# EAGLE design Tiny Tetris v1.3 (EAGLE 7.4.0)
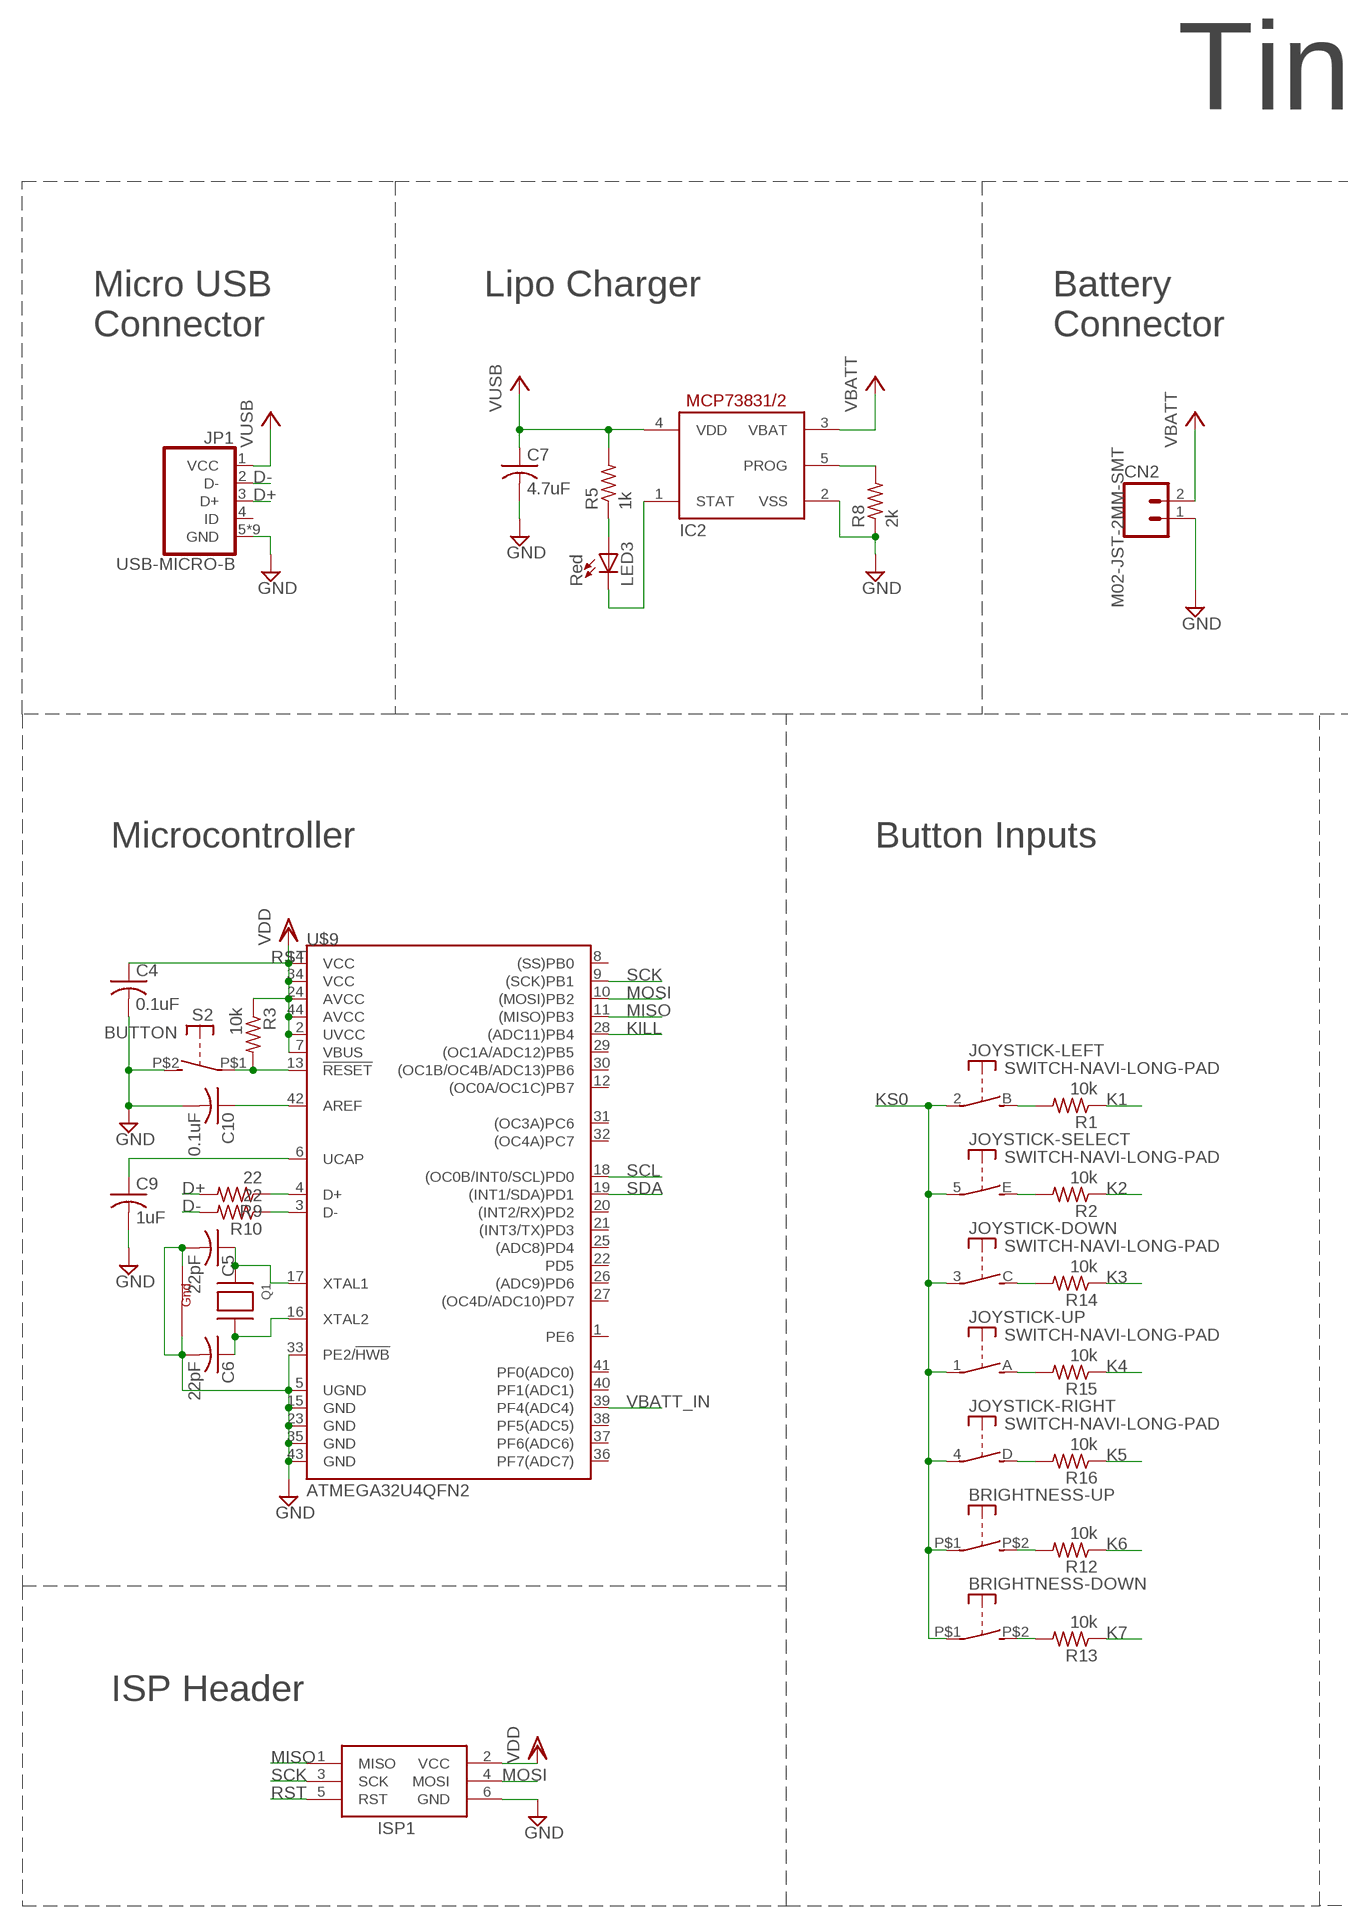
[diagram p0: schematic, sheet 1, part 1 of 2]
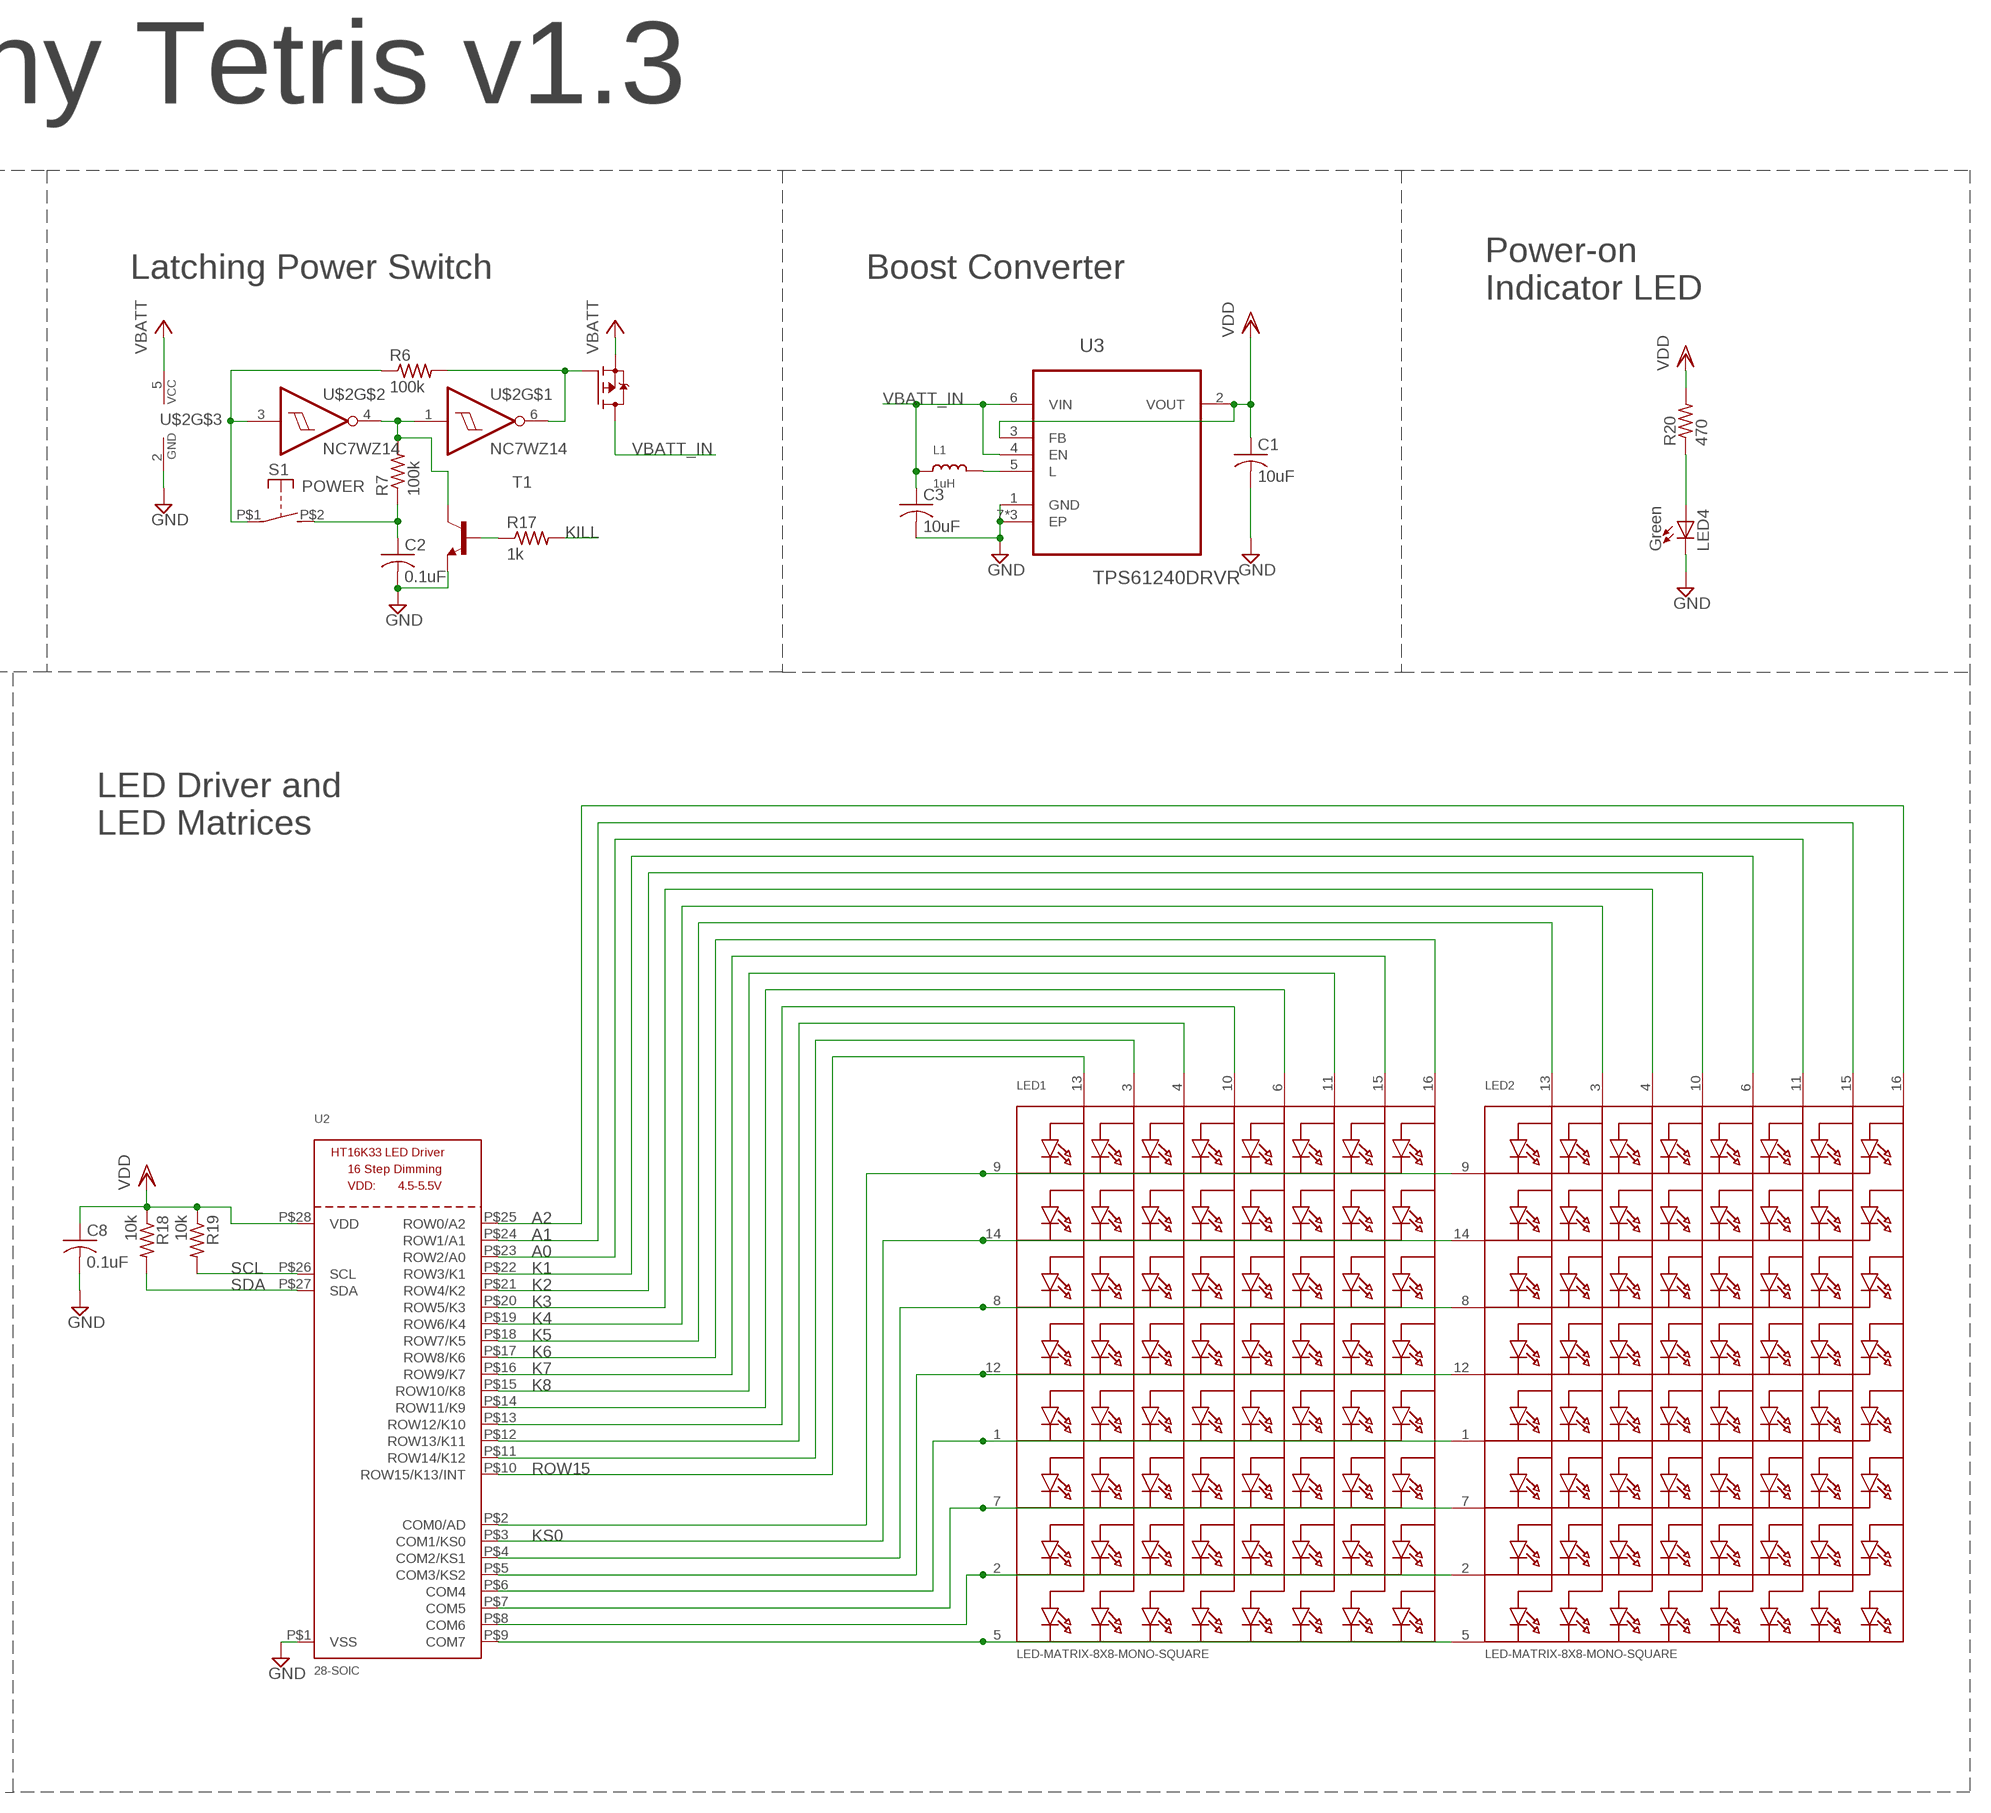
[diagram p1: schematic, sheet 1, part 2 of 2]

## Parts
BRIGHTNESS-DOWN  SWITCH-TACTSKRELGE010  [TACT-ALPS-SKRELGE010]
BRIGHTNESS-UP  SWITCH-TACTSKRELGE010  [TACT-ALPS-SKRELGE010]
C1  10uF  C-USC0603K  [C0603K]
C2  0.1uF  C-USC0603K  [C0603K]
C3  10uF  C-USC0603K  [C0603K]
C4  0.1uF  C-USC0603K  [C0603K]
C5  22pF  C-USC0603K  [C0603K]
C6  22pF  C-USC0603K  [C0603K]
C7  4.7uF  C-USC0603K  [C0603K]
C8  0.1uF  C-USC0603K  [C0603K]
C9  1uF  C-USC0603K  [C0603K]
C10  0.1uF  C-USC0603K  [C0603K]
CN2  M02-JST-2MM-SMT  M021X02_NO_SILK  [1X02_NO_SILK]
IC2  MCP73831/OT  [SOT23-5L]
ISP1  AVRISP-6  [AVRISP]
JOYSTICK-  SWITCH-NAVI-LONG-PAD  [JOYSTICK-NOKIA-3230-LONG-PAD]
JP1  USB-MICRO-B  [MICRO-USB-FCI-10103594]
L1  1uH  INDUCTOR0805  [0805]
LED1  LED-MATRIX-8X8-MONO-SQUARE  [LED-MATRIX-8X8-MONO-SQUARE]
LED2  LED-MATRIX-8X8-MONO-SQUARE  [LED-MATRIX-8X8-MONO-SQUARE]
LED3  Red  LED  [LED-0603-SIDEVIEW]
LED4  Green  LED  [LED-0603-SIDEVIEW]
Q1  XTAL-4-3225  [NX3225]
R1  10k  R-US_R0603  [R0603]
R2  10k  R-US_R0603  [R0603]
R3  10k  R-US_R0603  [R0603]
R5  1k  R-US_R0603  [R0603]
R6  100k  R-US_R0603  [R0603]
R7  100k  R-US_R0603  [R0603]
R8  2k  R-US_R0603  [R0603]
R9  22  R-US_R0603  [R0603]
R10  22  R-US_R0603  [R0603]
R12  10k  R-US_R0603  [R0603]
R13  10k  R-US_R0603  [R0603]
R14  10k  R-US_R0603  [R0603]
R15  10k  R-US_R0603  [R0603]
R16  10k  R-US_R0603  [R0603]
R17  1k  R-US_R0603  [R0603]
R18  10k  R-US_R0603  [R0603]
R19  10k  R-US_R0603  [R0603]
R20  470  R-US_R0603  [R0603]
S1  POWER  SWITCH-TACTSKRELGE010  [TACT-ALPS-SKRELGE010]
S2  BUTTON  SWITCH-TACTSKRELGE010  [TACT-ALPS-SKRELGE010]
T1  MMBT2222ALT1-NPN-SOT23-BEC  [SOT23-BEC]
U2  28-SOIC  HT16K33_SOP28  [SOP28_300MIL]
U3  TPS61240DRVR  [SON65P200X200X80-7N]
U$1  IRLML6402  [SOT23]
U$2  NC7WZ14  [SC-70-6]
U$9  ATMEGA32U4QFN2  [SPARKFUN-DIGITALIC_QFN-44-NOPAD]

## Nets
A0: LED2.11(A6) U2.P$23(ROW2/A0)
A1: LED2.15(A7) U2.P$24(ROW1/A1)
A2: LED2.16(A8) U2.P$25(ROW0/A2)
D+: JP1.3(D+) R9.2
D-: JP1.2(D-) R10.2
GND: C1.2 C2.2 C3.2 C4.2 C5.2 C6.2 C7.2 C8.2 C9.2 C10.2 CN2.1 IC2.2(VSS) ISP1.6(GND) JP1.5(GND) JP1.P$1(GND) JP1.P$2(GND) JP1.P$3(GND) JP1.P$4(GND) JP1.P$5(GND) JP1.P$6(GND) JP1.P$7(GND) JP1.P$8(GND) LED4.P$2(C) Q1.2(G2) Q1.4(G1) R8.1 S2.P$2(S) T1.E U2.P$1(VSS) U3.1(GND) U3.7(EP) U3.8(EP) U3.9(EP) U$2.2(GND) U$9.5(UGND) U$9.15(GND) U$9.23(GND) U$9.33(PE2/!HWB) U$9.35(GND) U$9.43(GND)
K1: LED2.6(A5) R1.1 U2.P$22(ROW3/K1)
K2: LED2.10(A4) R2.1 U2.P$21(ROW4/K2)
K3: LED2.4(A3) R14.1 U2.P$20(ROW5/K3)
K4: LED2.3(A2) R15.1 U2.P$19(ROW6/K4)
K5: LED2.13(A1) R16.1 U2.P$18(ROW7/K5)
K6: LED1.16(A8) R12.1 U2.P$17(ROW8/K6)
K7: LED1.15(A7) R13.1 U2.P$16(ROW9/K7)
K8: LED1.11(A6) U2.P$15(ROW10/K8)
KILL: R17.2 U$9.28((ADC11)PB4)
KS0: BRIGHTNESS-DOWN.P$1(P) BRIGHTNESS-UP.P$1(P) JOYSTICK-.1(UP:P) JOYSTICK-.2(LEFT:P) JOYSTICK-.3(DOWN:P) JOYSTICK-.4(RIGHT:P) JOYSTICK-.5(SELECT:P) LED1.14(K2) LED2.14(K2) U2.P$3(COM1/KS0)
MISO: ISP1.1(MISO) U$9.11((MISO)PB3)
MOSI: ISP1.4(MOSI) U$9.10((MOSI)PB2)
N$1: LED1.5(K8) LED2.5(K8) U2.P$9(COM7)
N$2: LED3.P$1(A) R5.1
N$3: JOYSTICK-.C(DOWN:S) R14.2
N$4: R6.2 U$1.1(G) U$2.6(O)
N$5: R17.1 T1.B
N$6: R6.1 S1.P$1(P) U$2.3(I)
N$7: JOYSTICK-.E(SELECT:S) R2.2
N$8: LED1.9(K1) LED2.9(K1) U2.P$2(COM0/AD)
N$9: JOYSTICK-.D(RIGHT:S) R16.2
N$10: C2.1 R7.1 S1.P$2(S)
N$11: JOYSTICK-.B(LEFT:S) R1.2
N$12: R7.2 T1.C U$2.1(I) U$2.4(O)
N$13: JOYSTICK-.A(UP:S) R15.2
N$15: C10.1 U$9.42(AREF)
N$16: R9.1 U$9.4(D+)
N$17: IC2.1(STAT) LED3.P$2(C)
N$18: IC2.5(PROG) R8.2
N$19: R10.1 U$9.3(D-)
N$20: C9.1 U$9.6(UCAP)
N$21: BRIGHTNESS-UP.P$2(S) R12.2
N$22: LED1.3(A2) U2.P$11(ROW14/K12)
N$23: LED1.4(A3) U2.P$12(ROW13/K11)
N$24: LED1.10(A4) U2.P$13(ROW12/K10)
N$25: LED1.6(A5) U2.P$14(ROW11/K9)
N$26: BRIGHTNESS-DOWN.P$2(S) R13.2
N$27: LED4.P$1(A) R20.1
N$29: L1.2 U3.5(L)
N$30: LED1.8(K3) LED2.8(K3) U2.P$4(COM2/KS1)
N$31: C5.1 Q1.1(X1) U$9.17(XTAL1)
N$32: LED1.12(K4) LED2.12(K4) U2.P$5(COM3/KS2)
N$33: LED1.1(K5) LED2.1(K5) U2.P$6(COM4)
N$34: LED1.7(K6) LED2.7(K6) U2.P$7(COM5)
N$35: LED1.2(K7) LED2.2(K7) U2.P$8(COM6)
N$36: C6.1 Q1.3(X2) U$9.16(XTAL2)
ROW15: LED1.13(A1) U2.P$10(ROW15/K13/INT)
RST: ISP1.5(RST) R3.2 S2.P$1(P) U$9.13(!RESET)
SCK: ISP1.3(SCK) U$9.9((SCK)PB1)
SCL: R19.2 U2.P$26(SCL) U$9.18((OC0B/INT0/SCL)PD0)
SDA: R18.2 U2.P$27(SDA) U$9.19((INT1/SDA)PD1)
VBATT: CN2.2 IC2.3(VBAT) U$1.2(S) U$2.5(VCC)
VBATT_IN: C3.1 L1.1 U3.4(EN) U3.6(VIN) U$1.3(D) U$9.39(PF4(ADC4))
VDD: C1.1 C4.1 C8.1 ISP1.2(VCC) R3.1 R18.1 R19.1 R20.2 U2.P$28(VDD) U3.2(VOUT) U3.3(FB) U$9.2(UVCC) U$9.7(VBUS) U$9.14(VCC) U$9.24(AVCC) U$9.34(VCC) U$9.44(AVCC)
VUSB: C7.1 IC2.4(VDD) JP1.1(VCC) R5.2
Unconnected: JP1.4(ID) U$9.1(PE6) U$9.8((SS)PB0) U$9.12((OC0A/OC1C)PB7) U$9.20((INT2/RX)PD2) U$9.21((INT3/TX)PD3) U$9.22(PD5) U$9.25((ADC8)PD4) U$9.26((ADC9)PD6) U$9.27((OC4D/ADC10)PD7) U$9.29((OC1A/ADC12)PB5) U$9.30((OC1B/OC4B/ADC13)PB6) U$9.31((OC3A)PC6) U$9.32((OC4A)PC7) U$9.36(PF7(ADC7)) U$9.37(PF6(ADC6)) U$9.38(PF5(ADC5)) U$9.40(PF1(ADC1)) U$9.41(PF0(ADC0))

## Notes on the sheet
- Tiny Tetris v1.3
- Power-on
  Indicator LED
- Micro USB
  Connector
- Lipo Charger
- Battery
  Connector
- Latching Power Switch | Boost Converter
- Microcontroller | Button Inputs
- LED Driver and 
  LED Matrices
- ISP Header

## Library data of the parts
BRIGHTNESS-DOWN BRIGHTNESS-UP S1 S2 = Jianan Li:SWITCH-TACT
C1-C10 = resistor:C-US: CAPACITOR, American symbol
CN2 = SparkFun-Connectors:M02: Standard 2-pin 0.1" header. Use with - straight break away headers ( PRT-00116) - right angle break away headers (PRT-00553) - swiss pins (PRT-00743) - machine pins (PRT-00117) - female headers (PRT-00115) Molex polarized connector foot print use with: PRT-08233 with associated crimp pins and housings. 2.54_SCREWTERM for use with PRT-10571. 3.5mm Screw Terminal footprints for PRT-08084 5mm Screw Terminal footprints for use with PRT-08433
IC2 = adafruit:MCP73831: MCP73831/2 Miniature Single-Cell, Fully Integrated Li-Ion, Li-Polymer Charge Management Controllers. Nice and small simple lipoly charge controller, with adjustable current and status output (LED) http://www.ladyada.net/library/pcb/eaglelibrary.html
ISP1 = adafruit:AVRISP: AVR ISP HEADER Standard 6 pin header for AVR programming
JOYSTICK- = Jianan Li:SWITCH-NAVI
JP1 = Jianan Li:USB-MICRO-B
L1 = microbuilder:INDUCTOR: Inductors 0603: 10nH Ceramic Inductor - microwire antenna/RF (Digikey: 712-1434-2-ND) 0805: 560nH Ceramic Inductor - RF (Digikey: 553-1047-1-ND) 270nH Ceramic Inductor - Q = 40@250MHz, +-5%, 1 Ohm DC Resistance (Digikey: 535-10506-2-ND) 1007 (2518 Metric) SMT: 10µH 10% 250mOhm 820mA 1007 Inductor (Digikey: 587-2189-1-ND) 22µH 10% 500mOhm 580mA 1007 Inductor (Digikey: 587-2190-1-ND) 47µH 10% 950mOhm 420mA 1007 Inductor (Digikey: 587-2191-1-ND) 47µH 5% 100mOhm 1A 1008 Inductor (Digikey: 732-1816-1-ND) 5.0x5.0mm (Taiyo Yuden NR5040 Series) 6.8µH 20% 2.3A 64mOhm Inductor (Digikey: 587-2374-2-ND) 5.0x5.0mm (TDK VLC5045 Series) 4.7µH 20% 3.3A 34mOhm Inductor (Digikey: 445-6526-1-ND) 6.8µH 20% 2.7A 46mOhm Inductor (Digikey: 445-6527-1-ND) 6.0x6.0mm (TDK VLC6045 Series) 4.7µH 20% 3.8A 27mOhm Inductor (Digikey: 445-6538-2-ND) 6.8µH 20% 3A 41mOhm Inductor (Digikey: 445-6540-1-ND) 6.2µH 30% 2.2A 45mOhm Inductor (Digikey: SRR5028-6R2YCT-ND) - Not TDK VLC6045 but footprint should match 6.0x6.0mm (TDK SLF6045 Series) 6.8uH 30% 2A 33mOhm Inductor (Digikey: 445-4572-1-ND, Mouser: 810-SLF645T6R8N2R0PF)
LED1 LED2 = Jianan Li:LED-MATRIX-8X8-MONO-SQUARE
LED3 LED4 = Jianan Li:LED
Q1 = adafruit:XTAL-4: Classic 4-pin 3.2 x 2.5mm crystal
R1-R3 R5-R10 R12-R20 = resistor:R-US_: RESISTOR, American symbol
T1 = transistor:*-NPN-: NPN Transistror BF959 corrected 2008.03.06
U2 = microbuilder:HT16K33_SOP28
U3 = Texas Instruments_By_element14_Batch_1:TPS61240DRVR: 3.5-MHz High Efficiency Step-Up Converter; MPN: TPS61240DRVR; OC_FARNELL: -; OC_NEWARK: 25R0113; PACKAGE: SON-6; SUPPLIER: Texas Instruments
U$1 = Jianan Li:IRLML6402
U$2 = Jianan Li:NC7WZ14
U$9 = SparkFun-DigitalIC:ATMEGA32U4: Atmel 44-pin 8-bit Microcontroller with 32KBytes of ISP Flash and USB Controller ----- Please use the QFN-44-NOPAD_1:1 package for the footprint of all boards using a 32U4. Route traces directly away from the pads as much as possible.

## Board
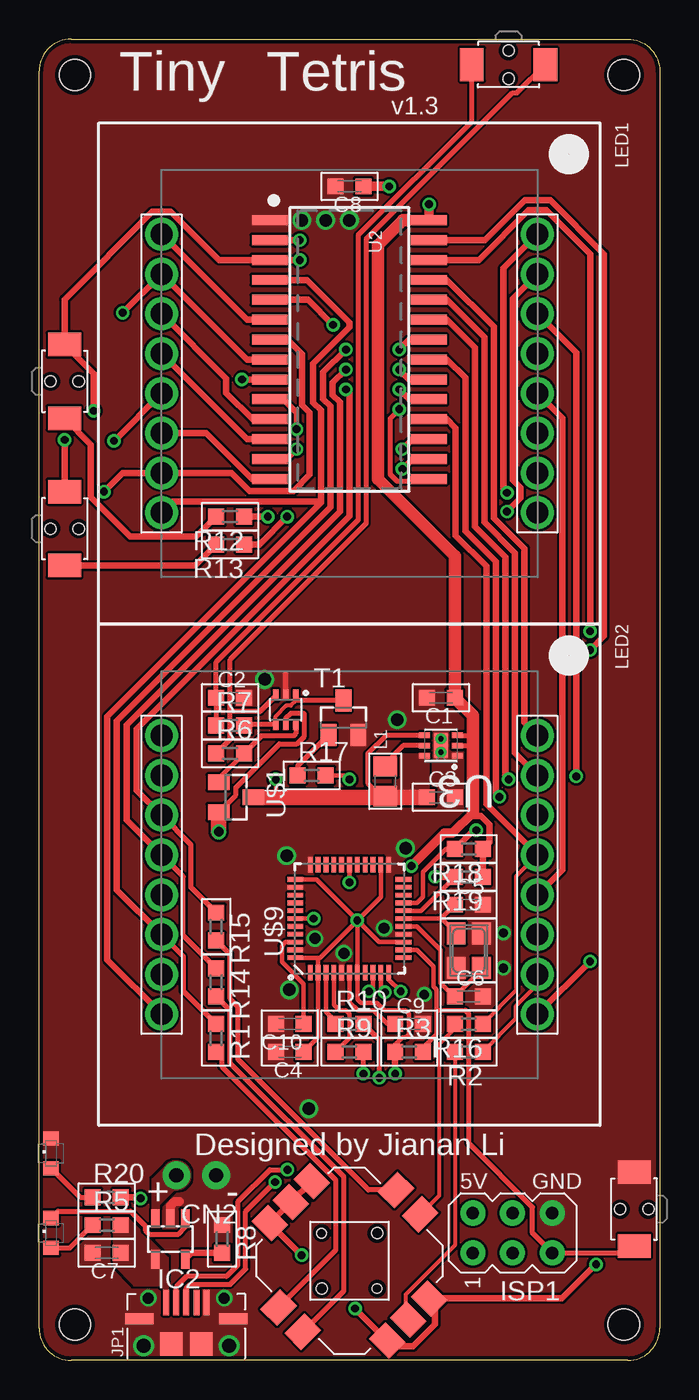
[diagram p2: board, top side]
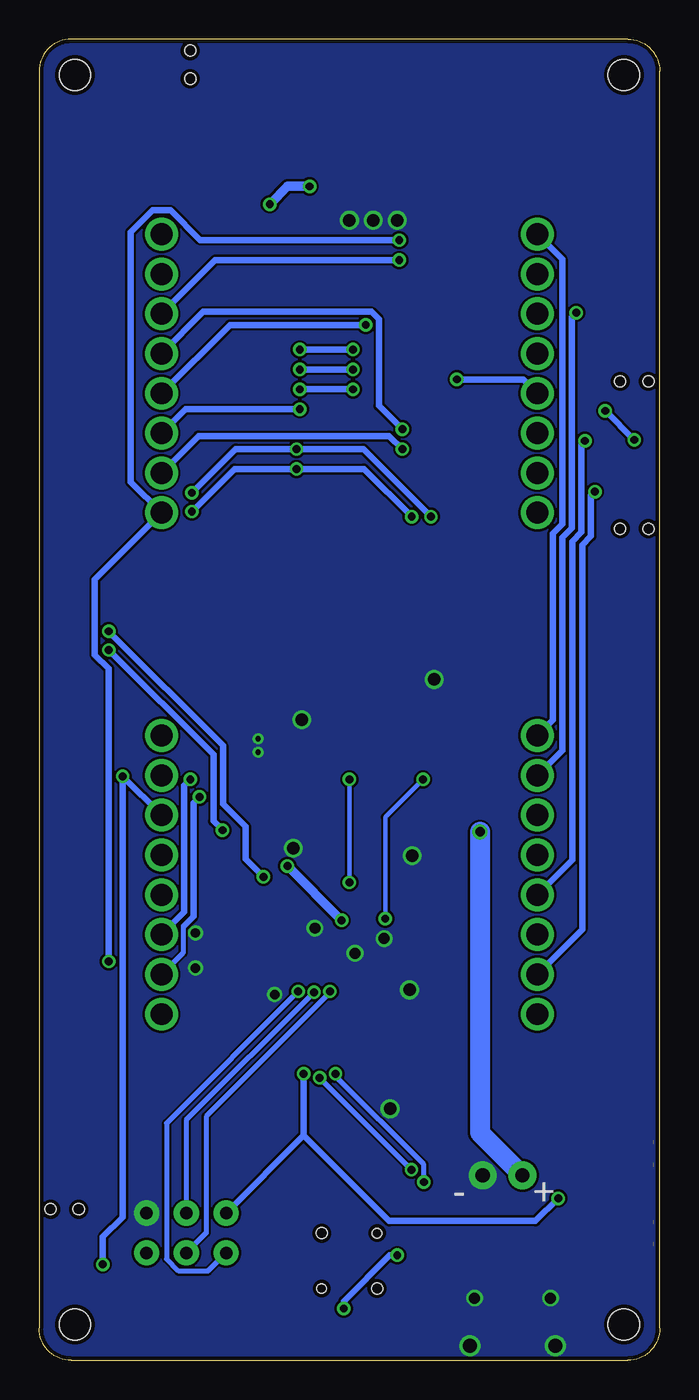
[diagram p3: board, bottom side, seen from below]

Size 39.62 x 84.33 mm. Coordinates in mm from the lower left corner, seen from the top.
Outline: 0,2.03 0,82.3 arc-90 2.03,84.33 37.59,84.33 arc-90 39.62,82.3 39.62,2.03 arc-90 37.59,0 2.03,0 arc-90 0,2.03
Copper layers (1*16): Top 0.0356mm / dielectric 1.5011mm / Bottom 0.0356mm
Design rules "OSH Park *": minimum track width 6mil, minimum drill 13mil, track to track 6mil, track to pad 6mil, pad to pad 6mil, via to via 6mil, smd to smd 6mil, copper to edge 10mil, drill to drill 6mil, minimum pad ring 7mil, minimum via ring 7mil, stop-mask expansion 0mil, vias tented up to drill 40mil, thermal gap 10mil
Holes 2 mm at 37.34,2.29 37.34,82.04 2.29,2.29 2.29,82.04

### Footprints (pad centres in the part's own frame; a part is rotated, then mirrored left to right if it is on the bottom)
TACT-ALPS-SKRELGE010 = smd 1.5 x 2.1: P$1 -2.35,0; P$2 2.35,0 | hole 0.7: 0,0.9; 0,-0.9
C0603K = smd 1.016 x 1.016: 1 -0.889,0; 2 0.889,0
1X02_NO_SILK = drill 0.9 pad 1.778: 1 0,0; 2 2.54,0
SOT23-5L = smd 0.55 x 1.2: 1 -0.95,-1.3; 2 0,-1.3; 3 0.95,-1.3; 4 0.95,1.3; 5 -0.95,1.3
AVRISP = drill 0.8 pad 1.6: 1 -1.27,2.54; 2 1.27,2.54; 3 -1.27,0; 4 1.27,0; 5 -1.27,-2.54; 6 1.27,-2.54
JOYSTICK-NOKIA-3230-LONG-PAD = smd 1.8 x 1.5 rotated 315: 1 -2.404,5.091; 2 -5.091,2.404; 3 2.404,-5.091; 4 5.091,-2.404; 5 -3.748,3.748; E 3.748,-3.748 | smd 1.5 x 1.8 rotated 315: A 2.97,4.525; B -4.525,-2.97; C -2.97,-4.525; D 4.525,2.97 | hole 0.7: 1.768,1.768; -1.768,-1.768 | hole 0.6: -1.768,1.768; 1.768,-1.768
MICRO-USB-FCI-10103594 = smd 0.38 x 1.6: 1 -1.3,3.561; 2 -0.65,3.561; 3 0,3.561; 4 0.65,3.561; 5 1.3,3.561 | drill 0.7: P$1 -2.425,3.841; P$2 2.425,3.841 | drill 0.9: P$3 -2.725,0.811; P$4 2.725,0.811 | smd 1.425 x 1.5: P$5 -0.963,0.901; P$6 0.963,0.901 | smd 1.825 x 0.7: P$7 -3,2.511; P$8 3,2.511
0805 = smd 1.3 x 1.5: 1 -0.95,0; 2 0.95,0
LED-MATRIX-8X8-MONO-SQUARE = drill 1.4 pad 2.032: 1 -8.89,-12; 2 -6.35,-12; 3 -3.81,-12; 4 -1.27,-12; 5 1.27,-12; 6 3.81,-12; 7 6.35,-12; 8 8.89,-12; 9 8.89,12; 10 6.35,12; 11 3.81,12; 12 1.27,12; 13 -1.27,12; 14 -3.81,12; 15 -6.35,12; 16 -8.89,12
LED-0603-SIDEVIEW = smd 0.9 x 1: P$1 -0.95,0; P$2 0.95,0
NX3225 = smd 1.4 x 1.2: 1 -1.1,-0.8; 2 1.1,-0.8; 3 1.1,0.8; 4 -1.1,0.8
R0603 = smd 1.016 x 1.016: 1 -0.889,0; 2 0.889,0
SOT23-BEC = smd 1 x 1.4: B -0.95,-1.1; C 0,1.1; E 0.95,-1.1
SOP28_300MIL = smd 0.635 x 2.286: P$1 -8.255,-5.08; P$2 -6.985,-5.08; P$3 -5.715,-5.08; P$4 -4.445,-5.08; P$5 -3.175,-5.08; P$6 -1.905,-5.08; P$7 -0.635,-5.08; P$8 0.635,-5.08; P$9 1.905,-5.08; P$10 3.175,-5.08; P$11 4.445,-5.08; P$12 5.715,-5.08; P$13 6.985,-5.08; P$14 8.255,-5.08; P$15 8.255,5.08; P$16 6.985,5.08; P$17 5.715,5.08; P$18 4.445,5.08; P$19 3.175,5.08; P$20 1.905,5.08; P$21 0.635,5.08; P$22 -0.635,5.08; P$23 -1.905,5.08; P$24 -3.175,5.08; P$25 -4.445,5.08; P$26 -5.715,5.08; P$27 -6.985,5.08; P$28 -8.255,5.08
SON65P200X200X80-7N = smd 0.7 x 0.35: 1 -1.05,0.65; 2 -1.05,0; 3 -1.05,-0.65; 4 1.05,-0.65; 5 1.05,0; 6 1.05,0.65 | smd 0.9 x 1.6: 7 0,0 | drill 0.33: 8 0,0.43; 9 0,-0.43
SOT23 = smd 1 x 1.4: 1 -0.95,-1.1; 2 0.95,-1.1; 3 0,1.1
SC-70-6 = smd 0.35 x 0.7: 1 -0.65,-0.95; 2 0,-0.95; 3 0.65,-0.95; 4 0.65,0.95; 5 0,0.95; 6 -0.65,0.95
SPARKFUN-DIGITALIC_QFN-44-NOPAD = smd 1 x 0.3: 1 -3.45,2.5; 2 -3.45,2; 3 -3.45,1.5; 4 -3.45,1; 5 -3.45,0.5; 6 -3.45,0; 7 -3.45,-0.5; 8 -3.45,-1; 9 -3.45,-1.5; 10 -3.45,-2; 11 -3.45,-2.5; 23 3.45,-2.5; 24 3.45,-2; 25 3.45,-1.5; 26 3.45,-1; 27 3.45,-0.5; 28 3.45,0; 29 3.45,0.5; 30 3.45,1; 31 3.45,1.5; 32 3.45,2; 33 3.45,2.5 | smd 0.3 x 1: 12 -2.5,-3.45; 13 -2,-3.45; 14 -1.5,-3.45; 15 -1,-3.45; 16 -0.5,-3.45; 17 0,-3.45; 18 0.5,-3.45; 19 1,-3.45; 20 1.5,-3.45; 21 2,-3.45; 22 2.5,-3.45; 34 2.5,3.45; 35 2,3.45; 36 1.5,3.45; 37 1,3.45; 38 0.5,3.45; 39 0,3.45; 40 -0.5,3.45; 41 -1,3.45; 42 -1.5,3.45; 43 -2,3.45; 44 -2.5,3.45

### Placement (x,y rotation side)
BRIGHTNESS-DOWN  1.63,53.09 270 top
BRIGHTNESS-UP  1.63,62.48 270 top
C1  25.65,42.29 180 top
C2  12.19,42.29 0 top
C3  25.65,35.94 0 top
C4  16,19.69 180 top
C5  27.43,29.08 0 top
C6  27.43,23.24 0 top
C7  4.32,6.86 180 top
C8  19.81,74.93 180 top
C9  23.62,21.46 0 top
C10  16,21.46 180 top
CN2  11.3,11.81 180 top
IC2  8.38,7.75 180 top
ISP1  30.23,8.13 90 top
JOYSTICK-  19.81,6.35 0 top
JP1  9.4,0.13 0 top
L1  22.1,36.96 90 top
LED1  19.81,62.99 270 top
LED2  19.81,30.99 270 top
LED3  0.76,8.13 90 top
LED4  0.76,13.21 90 top
Q1  27.43,26.16 270 top
R1  11.3,20.57 270 top
R2  27.43,19.69 180 top
R3  23.62,19.69 0 top
R5  4.32,8.64 0 top
R6  12.19,38.73 0 top
R7  12.19,40.51 0 top
R8  11.68,7.75 270 top
R9  19.81,19.69 0 top
R10  19.81,21.46 0 top
R12  12.19,53.85 180 top
R13  12.19,52.07 180 top
R14  11.3,24.13 270 top
R15  11.3,27.69 270 top
R16  27.43,21.46 180 top
R17  17.4,37.34 0 top
R18  27.43,32.64 180 top
R19  27.43,30.86 180 top
R20  4.32,10.41 0 top
S1  29.97,82.7 180 top
S2  38,9.65 90 top
T1  19.43,41.02 0 top
U2  19.81,64.52 270 top
U3  25.65,39.24 180 top
U$1  12.57,35.94 270 top
U$2  15.75,41.53 180 top
U$9  19.81,28.19 90 top

### Tracks (layer width: path | path; a pad name or v marks a point on that pad's centre or on a via)
A0  (via drill 0.5)
  Top 0.406: U2.P$23 26.04,66.42 27.81,64.64 27.81,53.21 29.77,51.26 29.77,37.29 v29.97,37.08
  Bottom 0.406: LED2.11 30.38,28.61 30.38,36.68 v29.97,37.08
A1
  Top 0.406: U2.P$24 26.04,67.69 28.42,65.3 28.42,53.49 30.38,51.54 30.38,38.77 LED2.15
A2
  Top 0.406: U2.P$25 26.04,68.96 29.03,65.96 29.03,53.77 30.99,51.82 30.99,40.7 LED2.16
D+  (via drill 0.5)
  Top 0.305: JP1.3 9.4,4.6 9.65,4.85 12.19,4.85 13.18,5.84 13.18,9.5 v15.06,11.38 | v20.7,18.29 R9.2
  Bottom 0.305: v15.06,11.38 15.06,12.5 20.7,18.14 v20.7,18.29
D-  (via drill 0.5)
  Top 0.305: JP1.2 8.75,4.68 9.42,5.36 11.96,5.36 12.68,6.07 12.68,10.11 14.73,12.17 v15.85,12.17 | v21.72,18.03 21.72,20.45 R10.2
  Bottom 0.305: v15.85,12.17 v21.72,18.03
GND  (via drill 0.6, 0.7, 0.8)
  Top 0.356: U$2.2 15.75,43.82
  Top 0.559: IC2.2 8.38,9.86 8.66,10.14 8.94,10.14
  other vias: 17.22,16.05 14.4,43.46 16.76,72.77 22.02,27.58 15.8,32.21 23.39,32.69 22.86,40.89 15.98,23.65 19.46,25.98 17.6,26.92 24.59,23.34 29.64,25.04 29.64,27.28 18.29,72.77 19.81,72.77
  pour Bottom (no thermals): 2.03,84.33 arc90 0,82.3 0,2.03 arc90 2.03,0 37.59,0 arc90 39.62,2.03 39.62,82.3 arc90 37.59,84.33
  pour Top (rank 6, no thermals): 2.03,84.33 arc90 0,82.3 0,2.03 arc90 2.03,0 37.59,0 arc90 39.62,2.03 39.62,82.3 arc90 37.59,84.33
K1  (via drill 0.5)
  Top 0.305: LED2.6 9.2,25.8 9.2,23.57 R1.1
  Top 0.406: LED2.6 4.95,30.04 4.95,40.82 18.59,54.46 18.59,60.91 18.14,61.37 18.14,63.07 v19.58,64.52 | v22.99,64.52 23.62,65.15 U2.P$22
  Bottom 0.406: v19.58,64.52 v22.99,64.52
K2  (via drill 0.5)
  Top 0.254: LED2.10 31.81,23.99 30.46,22.63 30.46,21.82 R2.1
  Top 0.406: U2.P$21 26.04,63.88 27.2,62.71 27.2,52.93 29.16,50.98 29.16,36.2 v29.39,35.97
  Bottom 0.305: 30.38,27.74 30.43,27.74 30.43,26.02 LED2.10
  Bottom 0.406: 30.38,27.74 29.77,28.35 29.77,35.59 v29.39,35.97
K3  (via drill 0.5)
  Top 0.305: R14.1 9.2,27.13 9.2,30.88 LED2.4
  Top 0.406: LED2.4 5.59,34.48 5.59,40.56 19.2,54.18 19.2,61.16 18.75,61.62 18.75,62.41 v19.58,63.25 | v22.99,63.25 23.62,62.61 U2.P$20
  Bottom 0.406: v19.58,63.25 v22.99,63.25
K4  (via drill 0.5)
  Top 0.305: R15.1 9.7,30.18 9.7,32.91 LED2.3
  Top 0.406: LED2.3 6.22,36.39 6.22,40.31 19.81,53.9 19.81,61.75 v19.58,61.98 | v22.99,61.98 23.62,61.34 U2.P$19
  Bottom 0.406: v19.58,61.98 v22.99,61.98
K5
  Top 0.254: LED2.13 30.46,30.9 30.46,23.6 R16.1
  Top 0.406: U2.P$18 26.04,60.07 26.59,59.51 26.59,52.65 28.55,50.7 28.55,35.52 LED2.13
K6  (via drill 0.5)
  Top 0.406: U2.P$17 23.83,58.8 v23.19,58.17 | LED1.16 29.64,69.71 29.64,55.6 v29.87,55.37 | v14.61,53.85 R12.1
  Bottom 0.406: v14.61,53.85 18.92,58.17 v23.19,58.17 27.08,58.17 v29.87,55.37
K7  (via drill 0.5)
  Top 0.406: U2.P$16 23.83,57.53 v23.19,56.9 | LED1.15 30.25,67.78 30.25,56.19 30.73,55.7 30.73,55.04 v29.87,54.18 | v15.84,53.85 14.06,52.07 R13.1
  Bottom 0.406: v29.87,54.18 27.15,56.9 v23.19,56.9 18.88,56.9 v15.84,53.85
K8  (via drill 0.5)
  Top 0.305: v22.99,60.71 22.4,60.12 22.4,56.57 22.86,56.11 23.52,56.11 23.67,56.26 U2.P$15
  Bottom 0.406: LED1.11 30.29,60.71 v22.99,60.71
KEEPOUT
  pour Top (no thermals): 15.42,42.75 16.08,42.75 16.08,42.21 15.42,42.21
  pour Top (no thermals): 9.78,4.6 10.24,4.6 10.24,2.97 9.78,2.97
  pour Top: 8,9.6 8.79,9.6 8.79,8.36 8,8.36
  pour Top: 26.43,39.41 26.97,39.41 26.97,39.04 26.43,39.04
KILL  (via drill 0.5)
  Top 0.279: U$9.28 v19.81,30.51 | v19.81,37.08 19.56,37.34 R17.2
  Bottom 0.279: v19.81,30.51 v19.81,37.08
KS0  (via drill 0.5)
  Top 0.406: v16.64,70.23 U2.P$3 11.48,70.23 8.41,73.3 7.21,73.3 1.63,67.72 BRIGHTNESS-UP.P$1 3.48,62.98 v3.48,60.6 | v34.29,37.28 34.29,64.32 LED1.14 | BRIGHTNESS-DOWN.P$1 v1.63,58.75 | JOYSTICK-.1 JOYSTICK-.5 | JOYSTICK-.5 | JOYSTICK-.5 | JOYSTICK-.5 JOYSTICK-.2 v16.76,6.71 | v20.17,3.3 JOYSTICK-.3 22.59,0.89 23.88,0.89 25.27,2.29 25.27,3.58 JOYSTICK-.4 33.38,3.95 v35.56,6.12
  Bottom 0.406: LED2.14 v34.29,37.28 34.29,9.14 35.56,7.87 v35.56,6.12 | v16.64,70.23 28.38,70.23 LED1.14 | v3.48,60.6 v1.63,58.75 | v16.76,6.71 17.24,6.71 20.17,3.78 v20.17,3.3
MISO  (via drill 0.5)
  Top 0.279: U$9.11 22.31,24.32 v23.09,23.55
  Bottom 0.305: ISP1.1 28.85,5.69 30.71,5.69 31.5,6.48 31.5,15.14 v23.09,23.55
MOSI  (via drill 0.5)
  Top 0.279: U$9.10 21.81,23.76 v22.07,23.5
  Bottom 0.305: ISP1.4 30.23,15.34 v22.07,23.5
N$1  (via drill 0.5)
  Top 0.406: LED1.5 v4.78,58.69 | v12.95,62.61 U2.P$9
  Bottom 0.406: LED2.5 5.59,31.94 5.59,52.27 5,52.86 5,58.46 v4.78,58.69 | LED1.5 8.7,62.61 v12.95,62.61
N$2
  Top 0.305: LED3.P$1 1.97,7.18 R5.1
N$3
  Top 0.305: JOYSTICK-.C 19.46,4.44 19.46,11.71 12.17,19 12.17,22.38 R14.2
N$4
  Top 0.279: U$1.1 11.47,37.13 R6.2
  Top 0.305: U$2.6 16.4,40.02 16.23,39.85 14.2,39.85 R6.2 13.06,38.73 | U$1.1 11.49,36.89
N$5
  Top 0.305: T1.B 16.51,37.95 R17.1
N$6
  Top 0.305: S1.P$1 30.52,80.9 30.23,80.9 20.88,71.55 20.88,53.42 12.19,44.73 12.19,41.4 | R6.1 12.19,39.62 12.19,41.4 | U$2.3 15.1,42.4 14.1,41.4 12.19,41.4
  Top 0.406: 32.53,82.7 S1.P$1
N$7
  Top 0.254: R2.2 26.54,7.34 23.39,4.19 23.39,2.77 JOYSTICK-.E
N$8  (via drill 0.5)
  Top 0.406: v16.64,71.5 U2.P$2 | v35.18,25.47 LED2.9
  Bottom 0.406: v16.64,71.5 29.34,71.5 31.24,73.41 32.39,73.41 33.78,72.01 33.78,56.07 LED1.9 36.07,49.85 36.07,45.03 35.18,44.15 v35.18,25.47
N$9
  Top 0.254: R16.2 26.54,21.18 25.53,20.17 25.53,10.51 JOYSTICK-.D
  Top 0.406: JOYSTICK-.D 24.36,9.34
N$10
  Top 0.305: S1.P$2 27.62,79.06 20.37,71.81 20.37,53.65 11.3,44.58 C2.1 R7.1
N$11
  Top 0.305: JOYSTICK-.B 18.95,7.04 18.95,11.48 11.66,18.77 11.66,19.33 R1.2
N$12
  Top 0.254: U$2.1 16.4,42.13 16.39,42.12 16.05,41.78 15.77,41.78 15.1,41.11 U$2.4
  Top 0.305: T1.C 16.39,42.12 16.39,42.47 U$2.1 | U$2.4 13.15,40.58 R7.2
N$13
  Top 0.305: JOYSTICK-.A 21.03,10.88 12.68,19.23 12.68,22.61 12.17,23.11 12.17,25.93 R15.2
N$15
  Top 0.279: U$9.42 15.72,26.69 15.49,26.47 15.49,25.43 16.89,24.03 C10.1
N$16
  Top 0.279: R9.1 19.81,20.57 19.81,22.1 19.58,22.33 19.18,22.33 18.81,22.69 U$9.4
N$17
  Top 0.305: IC2.1 9.33,8.49 8.89,8.05 7.04,8.05 6.78,8.31 6.78,8.59 5.84,9.52 1.21,9.52 LED3.P$2
N$18
  Top 0.406: R8.2 9.74,6.86 IC2.5
N$19
  Top 0.279: U$9.3 18.31,22.25 18.92,21.64 R10.1
N$20
  Top 0.279: 22.48,21.46 22.23,21.46 21.36,22.33 20.35,22.33 19.81,22.86 U$9.6
  Top 0.305: C9.1 22.48,21.46
N$21
  Top 0.406: BRIGHTNESS-UP.P$2 3.3,58.46 3.3,55.09 5.82,52.58 10.03,52.58 R12.2
N$22
  Top 0.406: LED1.3 11.94,62.68 11.94,61.75 13.61,60.07 U2.P$11 13.97,60.07
N$23
  Top 0.406: LED1.4 13.27,58.8 U2.P$12
N$24  (via drill 0.5)
  Top 0.406: v16.43,58.17 15.8,57.53 U2.P$13
  Bottom 0.406: LED1.10 29.45,59 17.27,59 v16.43,58.17
N$25
  Top 0.406: LED1.6 10.67,59.18 13.59,56.26 U2.P$14
N$26
  Top 0.406: BRIGHTNESS-DOWN.P$2 9.97,50.74 R13.2
N$27
  Top 0.305: LED4.P$1 2.61,10.41 R20.1
N$29
  Top 0.305: U3.5 23.24,39.24 22.1,38.1 L1.2
N$30
  Top 0.406: LED2.8 4.34,25.57 4.34,41.1 17.98,54.74 17.98,54.81 | U2.P$4 17.09,68.96 19.81,66.24 19.81,65.94 17.5,63.63 17.5,61.14 17.98,60.66 17.98,54.81 | LED1.8 8.52,54.81 17.98,54.81
N$31
  Top 0.279: U$9.17 25.4,28.19 25.65,28.19 | 25.65,28.19 25.7,28.19 Q1.1 | C5.1 25.65,28.19
N$32  (via drill 0.5)
  Top 0.406: LED1.12 33.4,60.13 33.4,31.31 LED2.12 | U2.P$5 17.17,67.69 v18.77,66.09
  Bottom 0.406: v18.77,66.09 27.44,66.09 LED1.12
N$33
  Top 0.406: U2.P$6 13.27,66.42 LED1.1
  Bottom 0.406: LED1.1 6.22,70.29 6.22,53.37 6.83,52.76 6.83,40.86 LED2.1
N$34  (via drill 0.5)
  Top 0.406: v4.14,55.45 5.33,56.64 LED1.7 12.29,56.64 13.44,55.5 16.23,55.5 17.27,56.54 17.27,60.48 16.79,60.96 16.79,64.21 15.85,65.15 U2.P$7
  Bottom 0.406: LED2.7 4.95,27.5 4.95,52.05 4.39,52.6 4.39,55.19 v4.14,55.45
N$35  (via drill 0.5)
  Top 0.406: U2.P$8 13.27,63.88 LED1.2 v5.33,66.86
  Bottom 0.406: LED2.2 6.22,38.93 6.22,52.5 5.61,53.11 5.61,66.59 v5.33,66.86
N$36
  Top 0.279: U$9.16 24.12,27.69 25.63,26.19 25.63,24.11 26.49,23.24 C6.1 28.23,24.93 Q1.3
ROW15  (via drill 0.5)
  Top 0.356: v16.43,59.44 16.43,60.48 15.57,61.34 U2.P$10
  Bottom 0.406: v16.43,59.44 17.93,60.94 17.93,66.45 18.42,66.93 29.15,66.93 LED1.13
RST
  Top 0.279: R3.2 24.51,19.94 25.38,20.8 25.38,22.35 | 27.2,22.35 25.38,22.35 | U$9.13 24.12,26.19 25.17,25.15 25.17,23.88 25.38,23.67 25.38,22.35
  Top 0.305: 27.2,22.35 27.43,22.12 27.43,13.84 31.5,9.78 31.5,8.13 ISP1.5 37.55,6.86 S2.P$1
SCK  (via drill 0.5)
  Top 0.279: U$9.9 21.31,23.8 v21.06,23.55
  Bottom 0.305: ISP1.3 28.96,8.13 28.96,15.57 21.06,23.47 v21.06,23.55
SCL  (via drill 0.5)
  Top 0.279: R19.2 24.38,28.69 U$9.18
  Top 0.406: v35.18,46.53 35.18,70.61 32.39,73.41 31.24,73.41 28.07,70.23 U2.P$26 | R19.2 v25.3,30.86
  Bottom 0.406: v35.18,46.53 27.89,39.24 27.89,35.51 26.44,34.06 26.44,32 v25.3,30.86
SDA  (via drill 0.5)
  Top 0.279: R18.2 25.98,32.64 24.51,31.17 24.51,29.59 24.11,29.19 U$9.19
  Top 0.406: U2.P$27 28.47,71.5 31.01,74.04 32.64,74.04 36.07,70.61 36.07,46.23 v35.18,45.34 | v27.91,33.83 27.74,33.83 R18.2
  Bottom 0.406: v35.18,45.34 28.5,38.66 28.5,34.42 v27.91,33.83
VBATT  (via drill 0.6)
  Top 0.305: U$2.5 15.75,40.97 16.08,41.3 16.87,41.3 16.94,41.22 16.94,39.83 16.46,39.34 15.34,39.34 12.57,36.58 12.57,36.09 U$1.2
  Top 1.003: U$1.2 v11.47,33.74
  Bottom 1.27: CN2.2 11.47,14.52 v11.47,33.74
  pour Top (no thermals): 7.24,9.55 7.24,11.56 8.13,12.45 arc-231 8.66,10.92 7.62,9.88 7.62,9.55
VBATT_IN  (via drill 0.5)
  Top 0.279: U$9.39 v17.53,28.19 | v15.11,37.08 15.11,35.94
  Top 0.305: U3.4 22.16,39.89 20.98,38.71 20.98,36.86 21.83,36.01 L1.1
  Top 0.813: L1.1 22.1,35.94
  Top 1.003: C3.1 22.1,35.94 15.11,35.94 U$1.3
  Bottom 0.279: v15.11,37.08 17.53,34.67 v17.53,28.19
  pour Top (no thermals): 24.87,38.68 22.71,38.68 22.71,35.51 24.87,35.51
VDD  (via drill 0.5)
  Top 0.279: R3.1 22.73,20.14 23.19,20.6 23.39,20.6 23.6,20.8 23.6,22.12 23.39,22.33 22.05,22.33 21.57,22.81 20.55,22.81 20.31,23.05 U$9.7 v20.31,28.08 | C4.1 17.81,20.61 U$9.2 17.81,25.58 17.92,25.69 | U$9.34 17.7,30.69 v20.31,28.08 | U$9.24 21.81,29.58 v20.31,28.08 | U$9.14 21.7,26.69 v20.31,28.08 | U$9.44 17.92,25.69 | 17.92,25.69 v20.31,28.08
  Top 0.305: U3.3 27.69,39.89 | U3.2 27.69,39.24
  Top 0.406: 23.5,72.77 U2.P$28 | v6.48,10.34 6.4,10.41 R20.2 | R3.1 v22.73,18.29 | R19.1 R18.1 28.75,33.07 28.75,34.19 28.19,34.75 27.74,34.75 27.74,34.9 27.69,34.95
  Top 0.61: C8.1 v22.35,74.93 | v24.89,73.79 U2.P$28 | v23.77,31.55 25.88,33.66 26.39,33.66 27.69,34.95
  Top 0.813: 23.5,72.77 23.24,72.77 21.64,71.17 21.64,56.24 26.54,51.33 C1.1 27.69,41.15 27.69,39.89 27.69,39.24 27.69,34.95
  Bottom 0.406: v6.48,10.34 7.93,8.89 17.27,8.89 22.73,14.35 | 22.73,14.35 ISP1.2 | v22.73,18.29 22.73,14.35
  Bottom 0.61: v22.35,74.93 23.75,74.93 v24.89,73.79 | v23.77,31.55 v20.31,28.08
VUSB
  pour Top (no thermals): 8.2,4.37 8.2,6.55 5.69,9.07 4.78,9.07 4.78,6.1 6.07,4.8 7.7,4.8 8,4.5 8,4.37

### Text on the board
tPlace: Tiny | Tetris | v1.3 | Designed by Jianan Li | 5V | GND | + | -
bPlace: + | -